# Altium schematic sheet MCU.SchDoc: FER_TEMPLATE
size A4; Author: Leon Baždar; CompanyName: FER; Address1: Zagreb; SheetNumber: 7; SheetTotal: 7
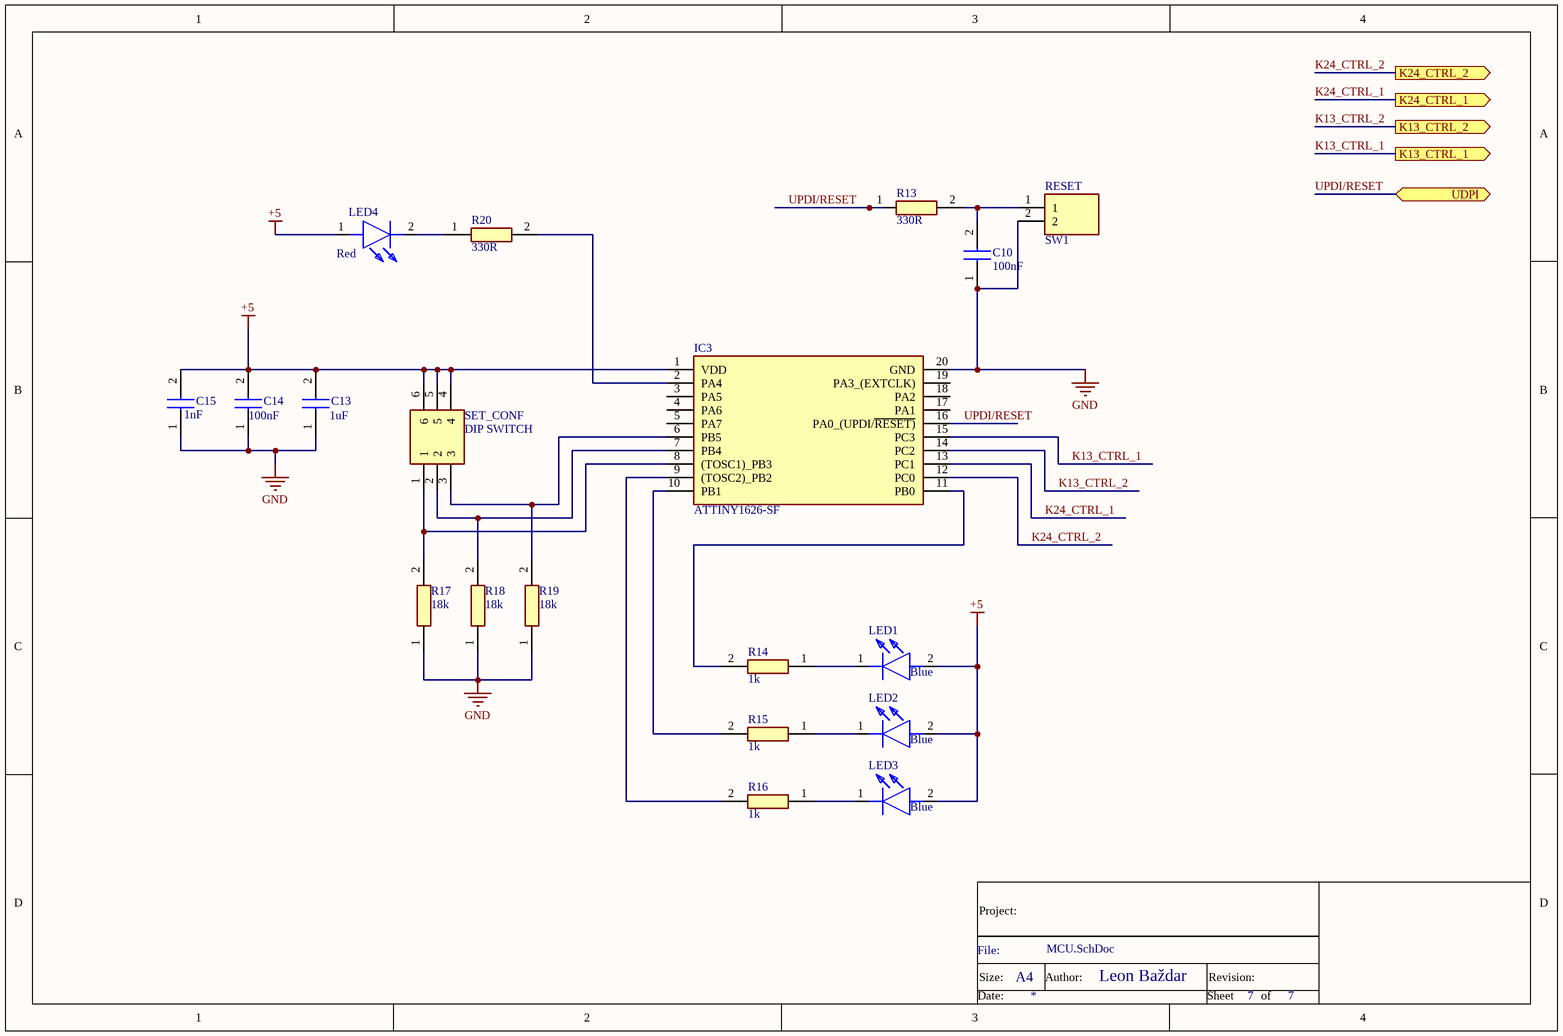
[diagram p0: MCU.SchDoc]

## Parts
C10  100nF  [CAPC1005X55N]
C13  1uF  [CAPC1005X55N]
C14  100nF  [CAPC1005X55N]
C15  1nF  [CAPC1005X55N]
IC3  ATTINY1626-SF  [SOIC127P1030X265-20N]
LED1  Blue  [LEDC2012X85N]
LED2  Blue  [LEDC2012X85N]
LED3  Blue  [LEDC2012X85N]
LED4  Red  [APT2012SECKJ3PRV]
R13  330R  [ERJ2RKD1004X]
R14  1k  [ERA2V_(0402)]
R15  1k  [ERA2V_(0402)]
R16  1k  [ERA2V_(0402)]
R17  18k  [RESC1005X35N]
R18  18k  [RESC1005X35N]
R19  18k  [RESC1005X35N]
R20  330R  [ERJ2RKD1004X]
RESET  SW1  [95C04A3GWRT]
SET_CONF  DIP SWITCH  [2193LPSTR]

## Ports
K13_CTRL_1 (out), K13_CTRL_2 (out), K24_CTRL_1 (out), K24_CTRL_2 (out), UDPI (bidir)

## Nets
+5: C13.2 C14.2 C15.2 IC3.1(VDD) LED1.2(A) LED2.2(A) LED3.2(A) LED4.1(A) SET_CONF.4 SET_CONF.5 SET_CONF.6
GND: C10.1 C13.1 C14.1 C15.1 IC3.20(GND) R17.1 R18.1 R19.1 RESET.2
K13_CTRL_1: IC3.15(PC3) ; port K13_CTRL_1
K13_CTRL_2: IC3.14(PC2) ; port K13_CTRL_2
K24_CTRL_1: IC3.13(PC1) ; port K24_CTRL_1
K24_CTRL_2: IC3.12(PC0) ; port K24_CTRL_2
UPDI/RESET: IC3.16(PA0_(UPDI/~{RESET)}) R13.1 ; port UDPI
NetC10_2: C10.2 R13.2 RESET.1
NetIC3_2: IC3.2(PA4) R20.2
NetIC3_6: IC3.6(PB5) R19.2 SET_CONF.3
NetIC3_7: IC3.7(PB4) R18.2 SET_CONF.2
NetIC3_8: IC3.8((TOSC1)_PB3) R17.2 SET_CONF.1
NetIC3_9: IC3.9((TOSC2)_PB2) R16.2
NetIC3_10: IC3.10(PB1) R15.2
NetIC3_11: IC3.11(PB0) R14.2
NetLED1_1: LED1.1(K) R14.1
NetLED2_1: LED2.1(K) R15.1
NetLED3_1: LED3.1(K) R16.1
NetLED4_2: LED4.2(K) R20.1

Not connected (* = marked no-connect by the designer): IC3 3(PA5) 4(PA6) 5(PA7) 17(PA1) 18(PA2) 19(PA3_(EXTCLK))

## Notes on the sheet
- Project:
- File:
- Size:
- A4
- Author:
- Revision:
- Date:
- Sheet
- of

## Library data of the parts
C10 C14 = GCM155L81E104KE02D: Capacitor; Manufacturer_Name: Murata Electronics; Datasheet Link: https://psearch.en.murata.com/capacitor/product/GCM155L81E104KE02%23.html; Height: 0.55mm; Manufacturer_Part_Number: GCM155L81E104KE02D
C13 = GRT155C81E105KE13D: Capacitor; Manufacturer_Name: Murata Electronics; Datasheet Link: https://psearch.en.murata.com/capacitor/product/GRT155C81E105KE13%23.html; Height: 0.55mm; Manufacturer_Part_Number: GRT155C81E105KE13D
C15 = CGA2B2C0G1H102J050BE: Capacitor; Manufacturer_Name: TDK; Datasheet Link: https://product.tdk.com/system/files/dam/doc/product/capacitor/ceramic/mlcc/catalog/mlcc_automotive_soft_en.pdf; Height: 0.55mm; Manufacturer_Part_Number: CGA2B2C0G1H102J050BE
IC3 = ATTINY1626-SF: Integrated Circuit; Manufacturer_Name: Microchip; Datasheet Link: https://ww1.microchip.com/downloads/aemDocuments/documents/MCU08/ProductDocuments/DataSheets/ATtiny1624-26-27-DataSheet-DS40002234B.pdf; Height: 2.65mm; Manufacturer_Part_Number: ATTINY1626-SF
LED1-LED3 = APT2012LVBC_D: LED; Manufacturer_Name: Kingbright; Manufacturer_Part_Number: APT2012LVBC/D; Datasheet Link: https://componentsearchengine.com//APT2012LVBC_D.pdf; Height: 0.85mm; Mouser2 Part Number: 604-APT2012LVBCD; Mouser2 Price/Stock: https://www.mouser.com/Search/Refine.aspx?Keyword=604-APT2012LVBCD
LED4 = APT2012SECK_J3-PRV: LED; Manufacturer_Name: Kingbright; Manufacturer_Part_Number: APT2012SECK/J3-PRV; Datasheet Link: https://www.mouser.de/datasheet/2/216/APT2012SECK-J3-PRV-1173389.pdf; Height: 0.85mm
R13 R20 = ERJ-2RHD3300X: Resistor; Manufacturer_Name: Panasonic; Datasheet Link: https://datasheet.datasheetarchive.com/originals/distributors/DKDS41/DSANUWW0038499.pdf; Height: 0.4mm; Manufacturer_Part_Number: ERJ-2RHD3300X
R14-R16 = ERA-2VEB1001X: Resistor; Manufacturer_Name: Panasonic; Datasheet Link: http://industrial.panasonic.com/cdbs/www-data/pdf/RDM0000/RDM0000C331.pdf; Height: 0.4mm; Manufacturer_Part_Number: ERA-2VEB1001X
R17-R19 = CPF0402B18KE1: Resistor; Manufacturer_Name: TE Connectivity; Height: 0.35mm; Manufacturer_Part_Number: CPF0402B18KE1
RESET = 95C04A3GWRT: Switch; Manufacturer_Name: Grayhill; Datasheet Link: https://componentsearchengine.com//95C04A3GWRT.pdf; Mouser2 Part Number: 706-95C04A3GWRT; Mouser2 Price/Stock: https://www.mouser.com/Search/Refine.aspx?Keyword=706-95C04A3GWRT; Manufacturer_Part_Number: 95C04A3GWRT
SET_CONF = 219-3LPSTR: Switch; Manufacturer_Name: CTS; Datasheet Link: https://www.ctscorp.com/wp-content/uploads/219.pdf; Height: 3.95mm; Manufacturer_Part_Number: 219-3LPSTR